# Altium schematic sheet Table of Contents and Information.SchDoc: Overview
size Tabloid; Author: Krutav Shah; DrawnBy: Krutav Shah; SheetNumber: 1; SheetTotal: 4; Inventory: SCH-00011
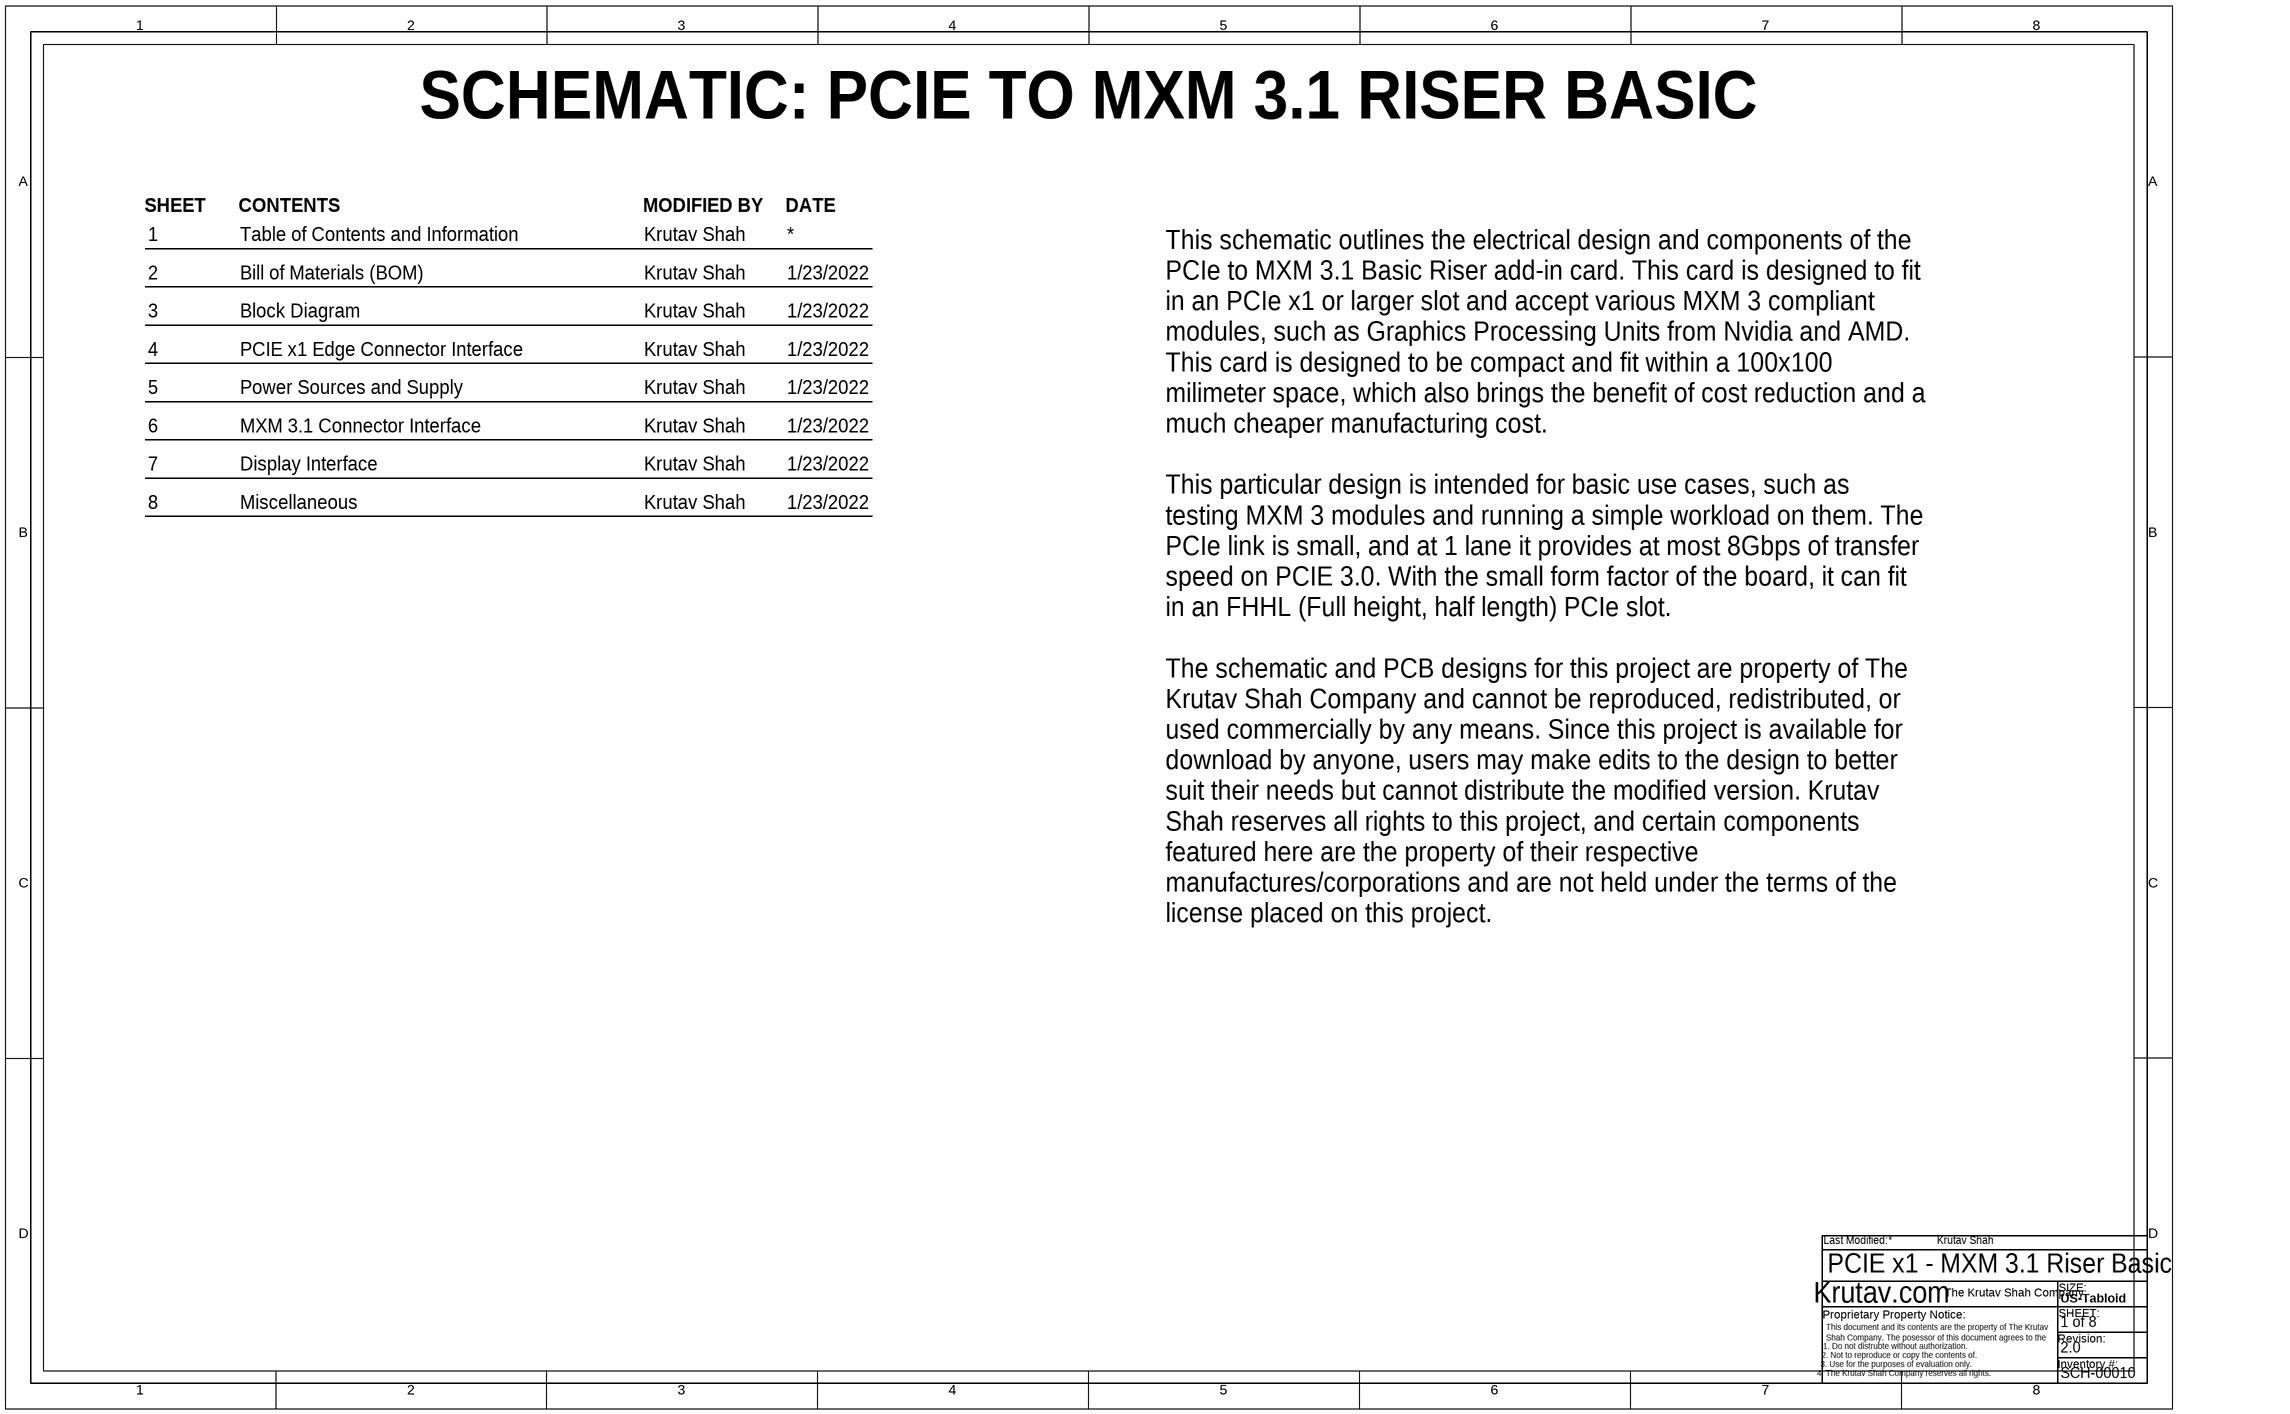
[diagram p0: Table of Contents and Information.SchDoc]

## Notes on the sheet
- SCHEMATIC: PCIE TO MXM 3.1 RISER BASIC
- SHEET
- CONTENTS
- MODIFIED BY
- DATE
- 1
- 2
- Table of Contents and Information
- Bill of Materials (BOM)
- 1/23/2022
- 3
- Block Diagram
- 4
- 5
- PCIE x1 Edge Connector Interface
- Power Sources and Supply
- 6
- 7
- MXM 3.1 Connector Interface
- Display Interface
- 8
- Miscellaneous
- This schematic outlines the electrical design and components of the PCIe to MXM 3.1 Basic Riser add-in card. This card is designed to fit in an PCIe x1 or larger slot and accept various MXM 3 compliant modules, such as Graphics Processing Units from Nvidia and AMD. This card is designed to be compact and fit within a 100x100 milimeter space, which also brings the benefit of cost reduction and a much cheaper manufacturing cost.
  This particular design is intended for basic use cases, such as testing MXM 3 modules and running a simple workload on them. The PCIe link is small, and at 1 lane it provides at most 8Gbps of transfer speed on PCIE 3.0. With the small form factor of the board, it can fit in an FHHL (Full height, half length) PCIe slot.
  The schematic and PCB designs for this project are property of The Krutav Shah Company and cannot be reproduced, redistributed, or used commercially by any means. Since this project is available for download by anyone, users may make edits to the design to better suit their needs but cannot distribute the modified version. Krutav Shah reserves all rights to this project, and certain components featured here are the property of their respective manufactures/corporations and are not held under the terms of the license placed on this project.
- PCIE x1 - MXM 3.1 Riser Basic
- 1 of 8
- 2.0
- SCH-00010
- Last Modified:
- Krutav.com
- The Krutav Shah Company
- US-Tabloid
- SIZE:
- SHEET:
- This document and its contents are the property of The Krutav Shah Company. The posessor of this document agrees to the following:
- Proprietary Property Notice:
- 1. Do not distrubte without authorization.
- 3. Use for the purposes of evaluation only.
- 2. Not to reproduce or copy the contents of.
- 4. The Krutav Shah Company reserves all rights.
- Revision:
- Inventory #: